# EAGLE board icyradio-exp-mmw-int (EAGLE 9.6.2), part 1 of 2
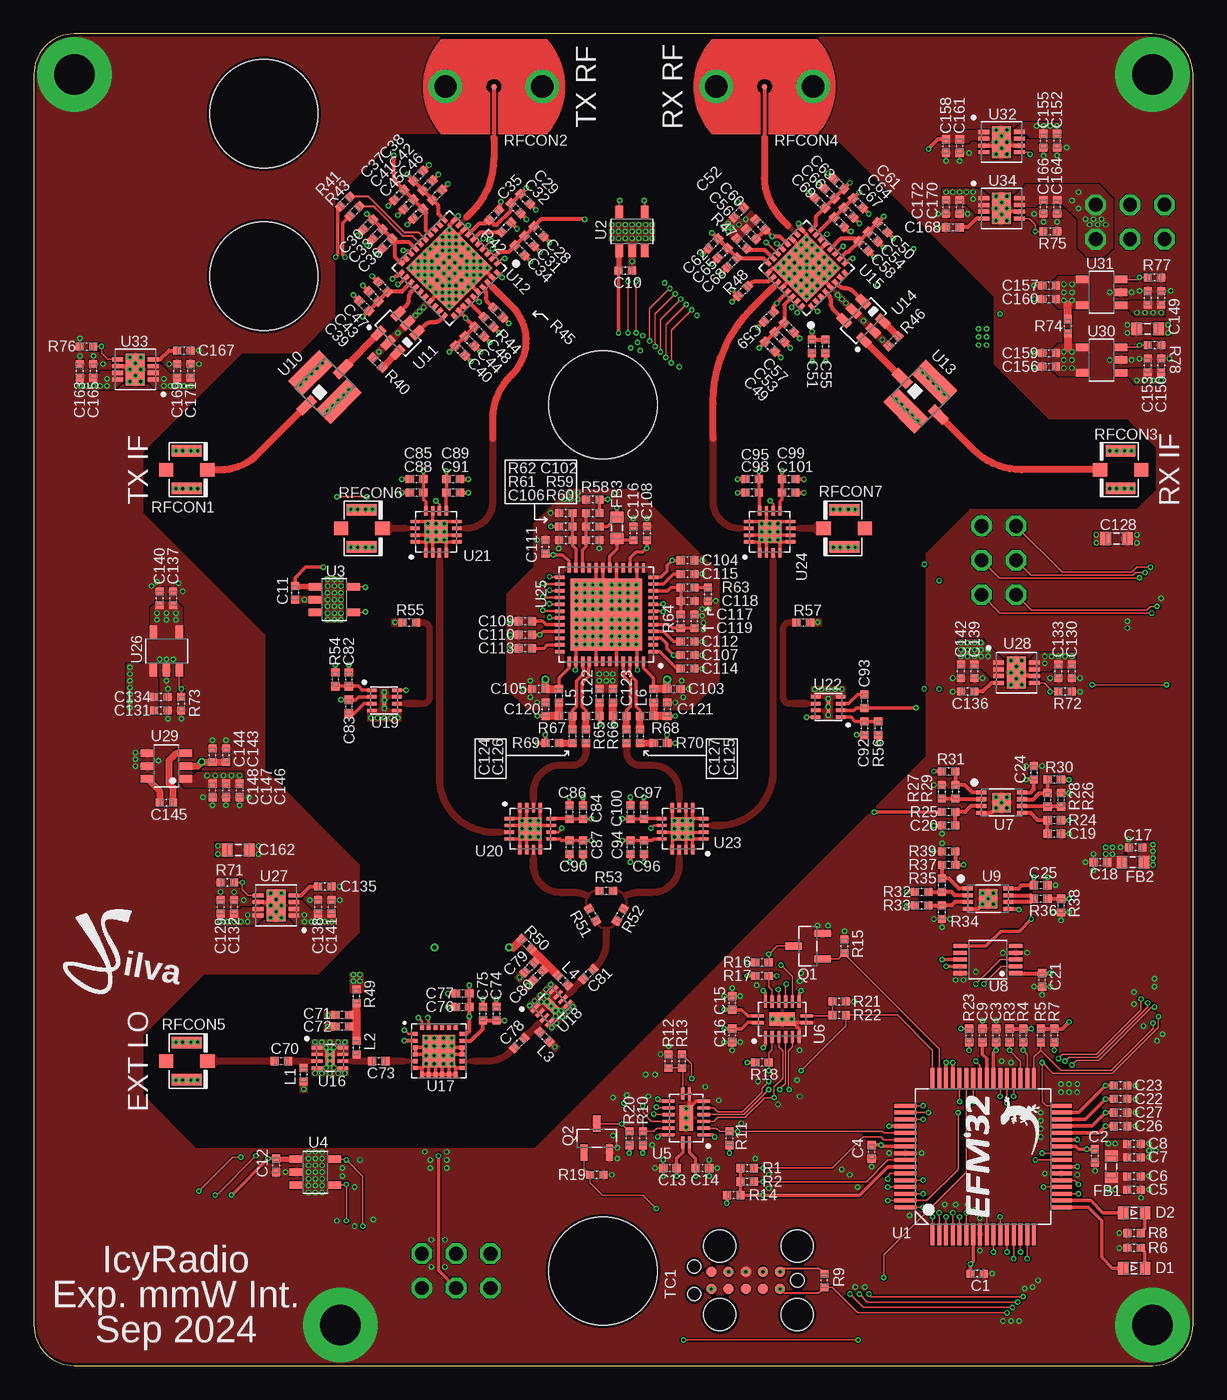
[diagram p11: board, top side]
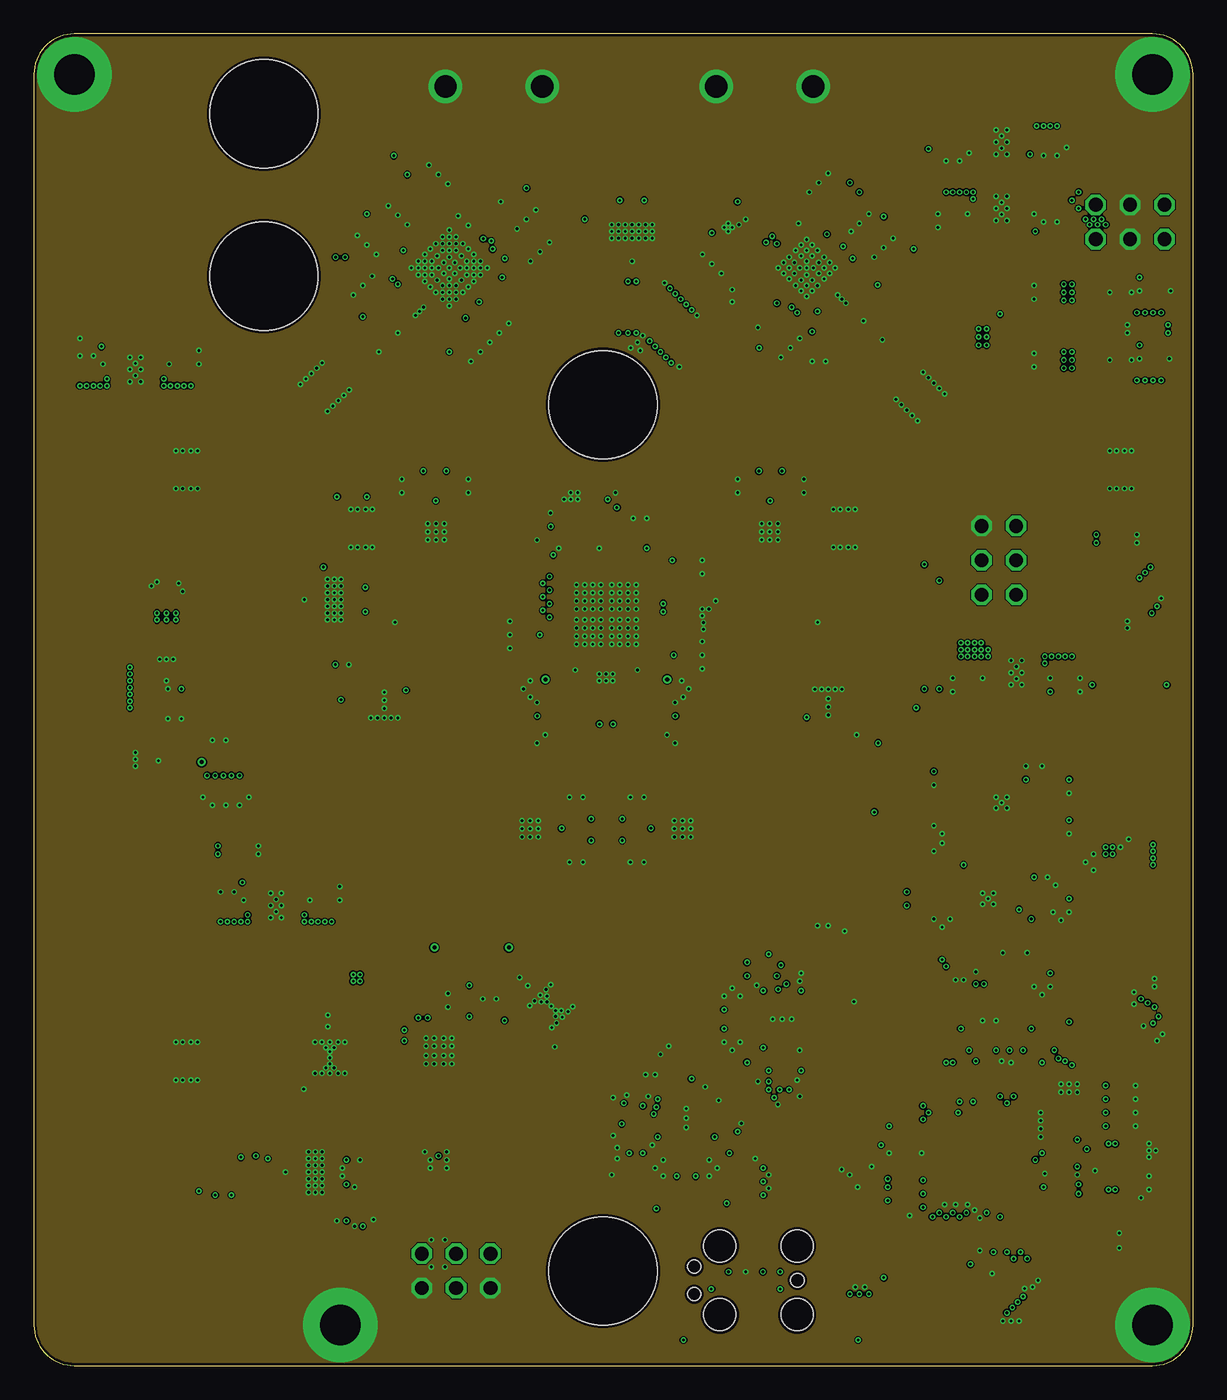
[diagram p12: board, inner layer Route2]
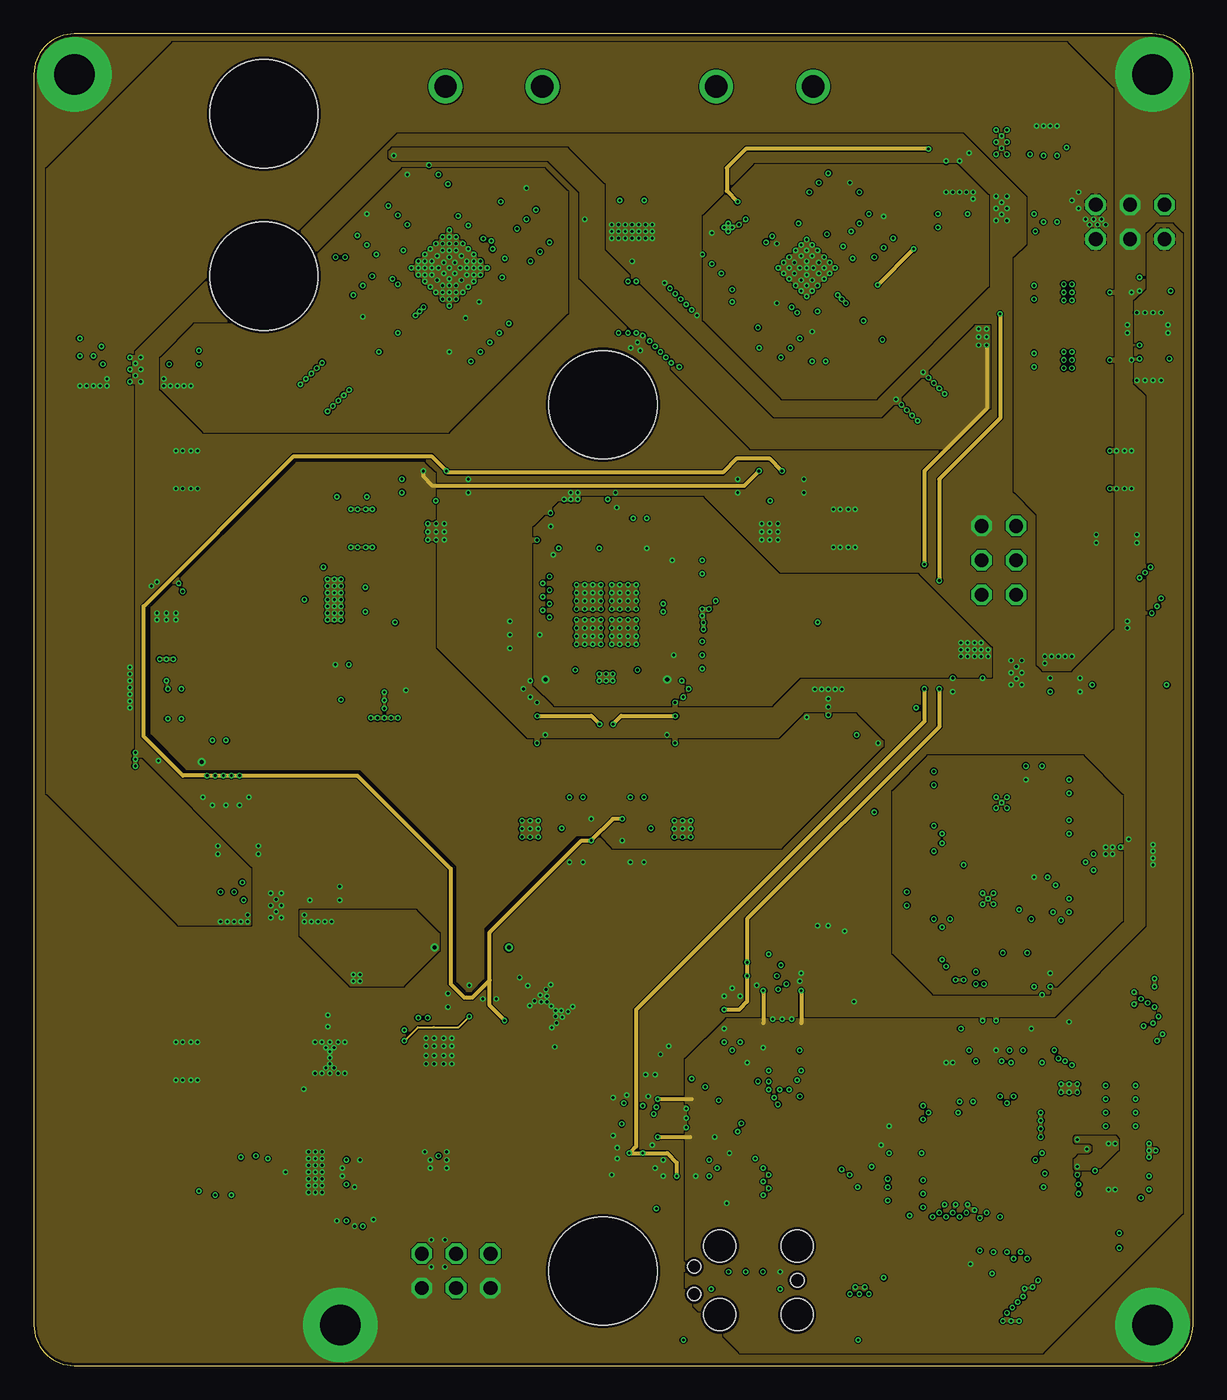
[diagram p13: board, inner layer Route15]
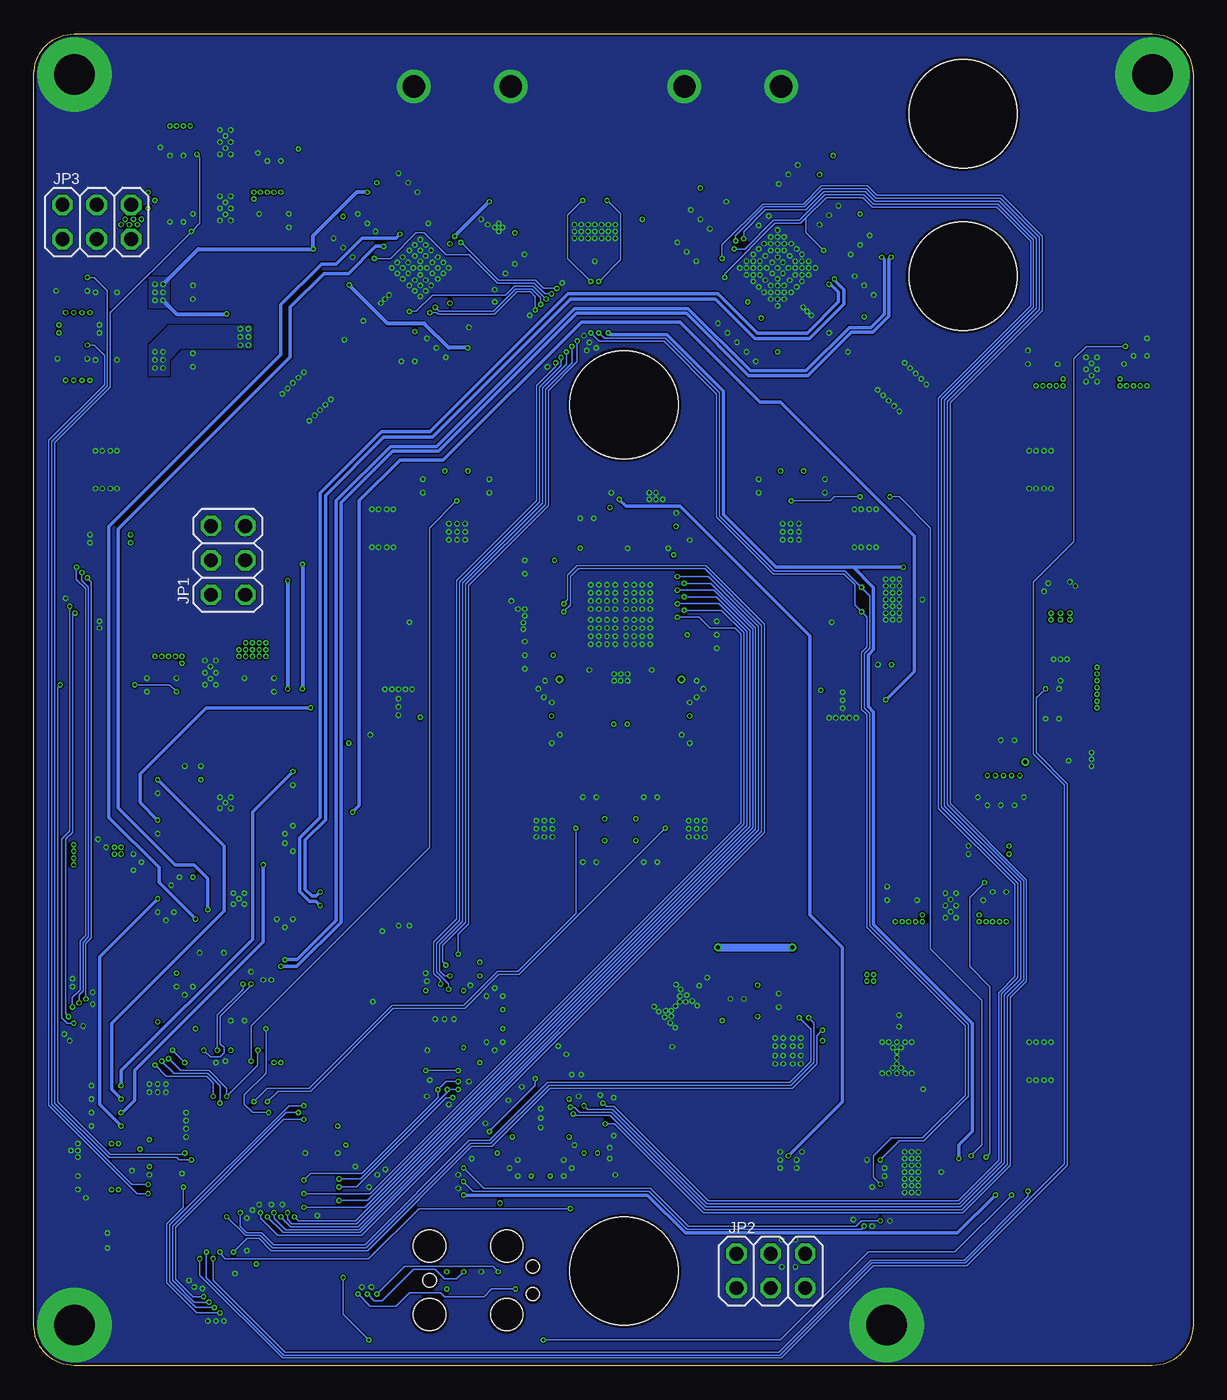
[diagram p14: board, bottom side, seen from below]

Size 85.65 x 98.4 mm. Coordinates in mm from the lower left corner, seen from the top.
Outline: 0,95.4 0,3 arc90 3,0 82.65,0 arc90 85.65,3 85.65,95.4 arc90 82.65,98.4 3,98.4 arc90 0,95.4
Copper layers (1+2*15+16): Top 0.035mm / dielectric 0.2mm / Route2 0.0175mm / dielectric 0.665mm / Route15 0.0175mm / dielectric 0.2mm / Bottom 0.035mm
Design rules "jlcpcb_4layer": minimum track width 3.5mil, minimum drill 0.2mm, track to track 3.5mil, track to pad 3.5mil, pad to pad 3.5mil, via to via 5mil, smd to smd 0mil, copper to edge 0.2mm, drill to drill 5mil, minimum pad ring 0.15mm, minimum via ring 0.1mm, stop-mask expansion 0.04mm, vias tented up to drill 10mm, thermal gap 3.5mil
Net classes: 1 Microstrip Diff Z50: width 0.254 mm, clearance 0.15 mm
Holes 8 mm at 42.05,71 17,80.5 17,92.5 42.05,7
bKeepout: area 0,4 to 8.2,12; area 0,16.5 to 8.2,24.5; area 0,29 to 8.2,37; area 0,41.5 to 8.2,49.5; area 0,54 to 8.2,62; area 0,66.5 to 8.2,74.5
tRestrict: area 65.4,34.6 to 65.8,35.4; area 65.4,33.6 to 65.8,34.4; area 66.7,35.3 to 67.5,35.7; area 66.7,33.3 to 67.5,33.7; area 67.4,36.6 to 67.8,37.4; area 67.4,37.6 to 67.8,38.4; area 74.2,34.1 to 74.6,34.9; area 74.2,35.1 to 74.6,35.9; area 75.5,33.8 to 76.3,34.2; area 67.4,39.5 to 67.8,40.3; area 67.4,40.5 to 67.8,41.3; area 66.7,42.2 to 67.5,42.6; 8 more areas

## Footprints (pad centres in the part's own frame; a part is rotated, then mirrored left to right if it is on the bottom)
CAP0402 = smd 0.6 x 0.6: 1 -0.5,0; 2 0.5,0
CAP0603 = smd 0.8 x 0.95: 1 -0.8,0; 2 0.8,0
0603 = smd 0.8 x 0.95: A 0.8,0; C -0.8,0
IND0603 = smd 0.8 x 0.95: 1 -0.8,0; 2 0.8,0
2X03 = drill 1.016 octagon: 1 -2.54,-1.27; 2 -2.54,1.27; 3 0,-1.27; 4 0,1.27; 5 2.54,-1.27; 6 2.54,1.27
IND0402 = smd 0.6 x 0.6: 1 -0.5,0; 2 0.5,0
SOT23 = smd 1.219 x 0.533: 1 -1.067,0.94; 2 -1.067,-0.94; 3 1.067,0
RES0402 = smd 0.6 x 0.6: 1 -0.5,0; 2 0.5,0
U.FL = smd 2.2 x 0.85: P$1 0,1.375; P$2 0,-1.375 | smd 1.05 x 1: P$3 1.525,0; P$4 -1.525,0
HK-R-SR2-SA = drill 1.65: GND@1 -3.58,0; GND@2 3.58,0 | smd 0.41 x 0.41: SIG 0,0
TC2050-IDC = smd 0.787 x 0.787: 1 -2.54,-0.635; 2 -1.27,-0.635; 3 0,-0.635; 4 1.27,-0.635; 5 2.54,-0.635; 6 2.54,0.635; 7 1.27,0.635; 8 0,0.635; 9 -1.27,0.635; 10 -2.54,0.635 | hole 0.991: -3.81,0; 3.81,1.016; 3.81,-1.016 | hole 2.375: -3.81,2.54; -3.81,-2.54; 1.905,2.54; 1.905,-2.54
QFP64 = smd 1.6 x 0.3: 1 -5.75,3.75; 2 -5.75,3.25; 3 -5.75,2.75; 4 -5.75,2.25; 5 -5.75,1.75; 6 -5.75,1.25; 7 -5.75,0.75; 8 -5.75,0.25; 9 -5.75,-0.25; 10 -5.75,-0.75; 11 -5.75,-1.25; 12 -5.75,-1.75; 13 -5.75,-2.25; 14 -5.75,-2.75; 15 -5.75,-3.25; 16 -5.75,-3.75; 33 5.75,-3.75; 34 5.75,-3.25; 35 5.75,-2.75; 36 5.75,-2.25; 37 5.75,-1.75; 38 5.75,-1.25; 39 5.75,-0.75; 40 5.75,-0.25; 41 5.75,0.25; 42 5.75,0.75; 43 5.75,1.25; 44 5.75,1.75; 45 5.75,2.25; 46 5.75,2.75; 47 5.75,3.25; 48 5.75,3.75 | smd 0.3 x 1.6: 17 -3.75,-5.75; 18 -3.25,-5.75; 19 -2.75,-5.75; 20 -2.25,-5.75; 21 -1.75,-5.75; 22 -1.25,-5.75; 23 -0.75,-5.75; 24 -0.25,-5.75; 25 0.25,-5.75; 26 0.75,-5.75; 27 1.25,-5.75; 28 1.75,-5.75; 29 2.25,-5.75; 30 2.75,-5.75; 31 3.25,-5.75; 32 3.75,-5.75; 49 3.75,5.75; 50 3.25,5.75; 51 2.75,5.75; 52 2.25,5.75; 53 1.75,5.75; 54 1.25,5.75; 55 0.75,5.75; 56 0.25,5.75; 57 -0.25,5.75; 58 -0.75,5.75; 59 -1.25,5.75; 60 -1.75,5.75; 61 -2.25,5.75; 62 -2.75,5.75; 63 -3.25,5.75; 64 -3.75,5.75
SOT23-5 = smd 1 x 0.55: 1 -1.4,0.95; 2 -1.4,0; 3 -1.4,-0.95; 4 1.4,-0.95; 5 1.4,0.95
DQFN16 = smd 0.24 x 0.9: 1 -0.25,1.8; 8 -0.25,-1.8; 9 0.25,-1.8; 16 0.25,1.8 | smd 0.9 x 0.24: 2 -1.3,1.25; 3 -1.3,0.75; 4 -1.3,0.25; 5 -1.3,-0.25; 6 -1.3,-0.75; 7 -1.3,-1.25; 10 1.3,-1.25; 11 1.3,-0.75; 12 1.3,-0.25; 13 1.3,0.25; 14 1.3,0.75; 15 1.3,1.25 | smd 1 x 1.9: 17 0,0
TDFN8 = smd 0.75 x 0.3: 1 -1.5,0.75; 2 -1.5,0.25; 3 -1.5,-0.25; 4 -1.5,-0.75; 5 1.5,-0.75; 6 1.5,-0.25; 7 1.5,0.25; 8 1.5,0.75 | smd 1.36 x 1.46: 9 0,0
MSOP10 = smd 0.3 x 1: 1 -1,-2.05; 2 -0.5,-2.05; 3 0,-2.05; 4 0.5,-2.05; 5 1,-2.05; 6 1,2.05; 7 0.5,2.05; 8 0,2.05; 9 -0.5,2.05; 10 -1,2.05
JV1210C = smd 1.5 x 0.7: 1 -1.9,0; 3 1.9,0 | smd 3.25 x 1.5: 2 0,-1.475; 4 0,1.475
FV1206-1 = smd 0.61 x 1.07: 1 -0.99,-1.025; 2 0,-1.025; 3 0.99,-1.025; 4 0.99,1.025; 5 0,1.025; 6 -0.99,1.025
LGA40 = smd 0.4 x 0.32: 1 -2.725,2.25; 2 -2.725,1.75; 3 -2.725,1.25; 4 -2.725,0.75; 5 -2.725,0.25; 6 -2.725,-0.25; 7 -2.725,-0.75; 8 -2.725,-1.25; 9 -2.725,-1.75; 10 -2.725,-2.25; 21 2.725,-2.25; 22 2.725,-1.75; 23 2.725,-1.25; 24 2.725,-0.75; 25 2.725,-0.25; 26 2.725,0.25; 27 2.725,0.75; 28 2.725,1.25; 29 2.725,1.75; 30 2.725,2.25 | smd 0.32 x 0.4: 11 -2.25,-2.725; 12 -1.75,-2.725; 13 -1.25,-2.725; 14 -0.75,-2.725; 15 -0.25,-2.725; 16 0.25,-2.725; 17 0.75,-2.725; 18 1.25,-2.725; 19 1.75,-2.725; 20 2.25,-2.725; 31 2.25,2.725; 32 1.75,2.725; 33 1.25,2.725; 34 0.75,2.725; 35 0.25,2.725; 36 -0.25,2.725; 37 -0.75,2.725; 38 -1.25,2.725; 39 -1.75,2.725; 40 -2.25,2.725 | smd 4.5 x 4.5: 41 0,0
LGA32 = smd 0.4 x 0.32: 1 -2.225,1.75; 2 -2.225,1.25; 3 -2.225,0.75; 4 -2.225,0.25; 5 -2.225,-0.25; 6 -2.225,-0.75; 7 -2.225,-1.25; 8 -2.225,-1.75; 17 2.225,-1.75; 18 2.225,-1.25; 19 2.225,-0.75; 20 2.225,-0.25; 21 2.225,0.25; 22 2.225,0.75; 23 2.225,1.25; 24 2.225,1.75 | smd 0.32 x 0.4: 9 -1.75,-2.225; 10 -1.25,-2.225; 11 -0.75,-2.225; 12 -0.25,-2.225; 13 0.25,-2.225; 14 0.75,-2.225; 15 1.25,-2.225; 16 1.75,-2.225; 25 1.75,2.225; 26 1.25,2.225; 27 0.75,2.225; 28 0.25,2.225; 29 -0.25,2.225; 30 -0.75,2.225; 31 -1.25,2.225; 32 -1.75,2.225 | smd 3.6 x 3.6: 33 0,0
MC1631-1 = smd 0.25 x 0.8: 1 -0.75,-0.95; 2 -0.25,-0.95; 3 0.25,-0.95; 4 0.75,-0.95; 5 0.75,0.95; 6 0.25,0.95; 7 -0.25,0.95; 8 -0.75,0.95 | smd 1.25 x 0.65: 9 0,0
LGA24 = smd 0.35 x 0.3: 1 -1.725,1.25; 2 -1.725,0.75; 3 -1.725,0.25; 4 -1.725,-0.25; 5 -1.725,-0.75; 6 -1.725,-1.25; 13 1.725,-1.25; 14 1.725,-0.75; 15 1.725,-0.25; 16 1.725,0.25; 17 1.725,0.75; 18 1.725,1.25 | smd 0.3 x 0.35: 7 -1.25,-1.725; 8 -0.75,-1.725; 9 -0.25,-1.725; 10 0.25,-1.725; 11 0.75,-1.725; 12 1.25,-1.725; 19 1.25,1.725; 20 0.75,1.725; 21 0.25,1.725; 22 -0.25,1.725; 23 -0.75,1.725; 24 -1.25,1.725 | smd 2.4 x 2.4: 25 0,0
DFN8_2X2 = smd 0.7 x 0.25: 1 -0.925,0.75; 2 -0.925,0.25; 3 -0.925,-0.25; 4 -0.925,-0.75; 5 0.925,-0.75; 6 0.925,-0.25; 7 0.925,0.25; 8 0.925,0.75 | smd 0.25 x 1.6: 9 0,0
LFCSP16 = smd 0.7 x 0.25: 1 -1.55,0.75; 2 -1.55,0.25; 3 -1.55,-0.25; 4 -1.55,-0.75; 9 1.55,-0.75; 10 1.55,-0.25; 11 1.55,0.25; 12 1.55,0.75 | smd 0.25 x 0.7: 5 -0.75,-1.55; 6 -0.25,-1.55; 7 0.25,-1.55; 8 0.75,-1.55; 13 0.75,1.55; 14 0.25,1.55; 15 -0.25,1.55; 16 -0.75,1.55 | smd 1.7 x 1.7: 17 0,0
VFQFPN48 = smd 0.7 x 0.25: 1 -3.45,2.75; 2 -3.45,2.25; 3 -3.45,1.75; 4 -3.45,1.25; 5 -3.45,0.75; 6 -3.45,0.25; 7 -3.45,-0.25; 8 -3.45,-0.75; 9 -3.45,-1.25; 10 -3.45,-1.75; 11 -3.45,-2.25; 12 -3.45,-2.75; 25 3.45,-2.75; 26 3.45,-2.25; 27 3.45,-1.75; 28 3.45,-1.25; 29 3.45,-0.75; 30 3.45,-0.25; 31 3.45,0.25; 32 3.45,0.75; 33 3.45,1.25; 34 3.45,1.75; 35 3.45,2.25; 36 3.45,2.75 | smd 0.25 x 0.7: 13 -2.75,-3.45; 14 -2.25,-3.45; 15 -1.75,-3.45; 16 -1.25,-3.45; 17 -0.75,-3.45; 18 -0.25,-3.45; 19 0.25,-3.45; 20 0.75,-3.45; 21 1.25,-3.45; 22 1.75,-3.45; 23 2.25,-3.45; 24 2.75,-3.45; 37 2.75,3.45; 38 2.25,3.45; 39 1.75,3.45; 40 1.25,3.45; 41 0.75,3.45; 42 0.25,3.45; 43 -0.25,3.45; 44 -0.75,3.45; 45 -1.25,3.45; 46 -1.75,3.45; 47 -2.25,3.45; 48 -2.75,3.45 | smd 5.3 x 5.3: 49 0,0
LFCSP8_3X3 = smd 0.8 x 0.3: 1 -1.315,0.75; 2 -1.315,0.25; 3 -1.315,-0.25; 4 -1.315,-0.75; 5 1.315,-0.75; 6 1.315,-0.25; 7 1.315,0.25; 8 1.315,0.75 | smd 1.4 x 2.36: 9 0,0
SOT23-6 = smd 1 x 0.55: 1 -1.4,0.95; 2 -1.4,0; 3 -1.4,-0.95; 4 1.4,-0.95; 5 1.4,0; 6 1.4,0.95

## Placement (x,y rotation side)
C1  100nF  [CAP0402]  69.7,6.8 0 top
C2  100nF  [CAP0402]  78.4,15.5 270 top
C3  100nF  [CAP0402]  71.1,24.4 90 top
C4  100nF  [CAP0402]  61.9,15.8 270 top
C5  100nF  [CAP0402]  81.3,13 0 top
C6  1uF  [CAP0402]  81.3,14 0 top
C7  10uF  [CAP0402]  81.3,15.4 0 top
C8  100nF  [CAP0402]  81.3,16.4 0 top
C9  1uF  [CAP0402]  70.1,24.4 90 top
C10  100nF  [CAP0402]  43.7,80.9 0 top
C11  100nF  [CAP0402]  19.3,57.1 270 top
C12  100nF  [CAP0402]  17.9,14.8 270 top
C13  100nF  [CAP0402]  47,14.6 180 top
C14  100nF  [CAP0402]  49.4,14.6 0 top
C15  100nF  [CAP0402]  51.6,26.8 90 top
C16  100nF  [CAP0402]  51.6,24.4 270 top
C17  1uF  [CAP0402]  81.4,38.3 180 top
C18  10uF  [CAP0402]  78.8,37.2 180 top
C19  1nF  [CAP0402]  75.4,39.3 0 top
C20  1nF  [CAP0402]  67.6,39.9 180 top
C21  100nF  [CAP0402]  74.5,28.5 270 top
C22  100nF  [CAP0402]  80.3,19.7 0 top
C23  100nF  [CAP0402]  80.3,20.7 0 top
C24  100nF  [CAP0402]  73.9,43.8 90 top
C25  100nF  [CAP0402]  74.4,35.5 0 top
C26  330pF  [CAP0402]  80.3,17.7 0 top
C27  330pF  [CAP0402]  80.3,18.7 0 top
C28  10uF  [CAP0402]  37.3,83.8 315 top
C29  10uF  [CAP0402]  36.3,86.2 315 top
C30  10uF  [CAP0402]  24.7,84.3 225 top
C31  10nF  [CAP0402]  36.6,83.1 315 top
C32  10nF  [CAP0402]  35.6,85.5 315 top
C33  10nF  [CAP0402]  25.4,83.6 225 top
C34  100pF  [CAP0402]  35.9,82.4 315 top
C35  100pF  [CAP0402]  34,85 45 top
C36  100pF  [CAP0402]  26.1,82.9 225 top
C37  10uF  [CAP0402]  27,86.5 225 top
C38  10uF  [CAP0402]  28.4,87.9 45 top
C39  10uF  [CAP0402]  24.4,78.3 135 top
C40  10uF  [CAP0402]  31.5,75 315 top
C41  10nF  [CAP0402]  27.7,85.8 225 top
C42  10nF  [CAP0402]  29.1,87.2 45 top
C43  10nF  [CAP0402]  25.1,79 135 top
C44  10nF  [CAP0402]  32.2,75.7 315 top
C45  100pF  [CAP0402]  28.4,85.1 225 top
C46  100pF  [CAP0402]  29.8,86.5 45 top
C47  100pF  [CAP0402]  25.8,79.7 135 top
C48  100pF  [CAP0402]  32.9,76.4 315 top
C49  10uF  [CAP0402]  54.4,75.3 315 top
C50  10uF  [CAP0402]  62.7,84.1 315 top
C51  10uF  [CAP0402]  57.5,75.3 270 top
C52  10uF  [CAP0402]  52.1,85.2 225 top
C53  10nF  [CAP0402]  55.1,76 315 top
C54  10nF  [CAP0402]  62,83.4 315 top
C55  10nF  [CAP0402]  58.5,75.3 270 top
C56  10nF  [CAP0402]  53,83.6 135 top
C57  100pF  [CAP0402]  55.8,76.7 315 top
C58  100pF  [CAP0402]  61.3,82.7 315 top
C59  100pF  [CAP0402]  54.3,77.5 225 top
C60  100pF  [CAP0402]  53.7,84.3 135 top
C61  10uF  [CAP0402]  60.9,85.9 315 top
C62  10uF  [CAP0402]  50.2,82.9 225 top
C63  10uF  [CAP0402]  59.5,87.3 135 top
C64  10nF  [CAP0402]  60.2,85.2 315 top
C65  10nF  [CAP0402]  50.9,82.2 225 top
C66  10nF  [CAP0402]  58.8,86.6 135 top
C67  100pF  [CAP0402]  59.5,84.5 315 top
C68  100pF  [CAP0402]  51.6,81.5 225 top
C69  100pF  [CAP0402]  58.1,85.9 135 top
C70  2.2pF  [CAP0402]  18.28,22.5 0 top
C71  10uF  [CAP0402]  22.78,25.91 180 top
C72  2.2pF  [CAP0402]  22.78,25.06 180 top
C73  2.2pF  [CAP0402]  25.49,22.5 0 top
C74  100nF  [CAP0402]  34.18,26 90 top
C75  100pF  [CAP0402]  33.18,26 90 top
C76  100pF  [CAP0402]  31.68,26.5 180 top
C77  100nF  [CAP0402]  31.68,27.5 180 top
C78  2.2pF  [CAP0402]  35.87,23.84 45 top
C79  10uF  [CAP0402]  36.64,29.43 225 top
C80  2.2pF  [CAP0402]  37.24,28.83 225 top
C81  2.2pF  [CAP0402]  40.96,28.93 45 top
C82  100nF  [CAP0402]  23.28,50.7 90 top
C83  10nF  [CAP0402]  23.28,48.7 270 top
C84  100nF  [CAP0402]  40.58,40.9 90 top
C85  100nF  [CAP0402]  28.28,65.5 180 top
C86  100pF  [CAP0402]  39.58,40.9 90 top
C87  100nF  [CAP0402]  40.58,38.3 270 top
C88  100pF  [CAP0402]  28.28,64.5 180 top
C89  100nF  [CAP0402]  30.98,65.5 0 top
C90  100pF  [CAP0402]  39.58,38.3 270 top
C91  100pF  [CAP0402]  30.98,64.5 0 top
C92  100nF  [CAP0402]  61.38,47.1 270 top
C93  10nF  [CAP0402]  61.38,49.1 90 top
C94  100nF  [CAP0402]  44.08,38.3 270 top
C95  100nF  [CAP0402]  53.08,65.5 180 top
C96  100pF  [CAP0402]  45.08,38.3 270 top
C97  100nF  [CAP0402]  45.08,40.9 90 top
C98  100pF  [CAP0402]  53.08,64.5 180 top
C99  100nF  [CAP0402]  55.78,65.5 0 top
C100  100pF  [CAP0402]  44.08,40.9 90 top
C101  100pF  [CAP0402]  55.78,64.5 0 top
C102  100nF  [CAP0402]  41.3,63 180 top
C103  100nF  [CAP0402]  47.3,50 0 top
C104  100nF  [CAP0402]  48.3,59.5 0 top
C105  100nF  [CAP0402]  37.3,50 180 top
C106  100nF  [CAP0402]  39.3,61 180 top
C107  100nF  [CAP0402]  48.3,52.5 0 top
C108  100nF  [CAP0402]  45.3,61.5 90 top
C109  22uF  [CAP0402]  36.3,55 180 top
C110  100nF  [CAP0402]  36.3,54 180 top
C111  100nF  [CAP0402]  37.8,60.5 90 top
C112  22uF  [CAP0402]  48.3,53.5 0 top
C113  22uF  [CAP0402]  36.3,53 180 top
C114  22uF  [CAP0402]  48.3,51.5 0 top
C115  22uF  [CAP0402]  48.3,58.5 0 top
C116  1uF  [CAP0402]  44.3,61.5 90 top
C117  1uF  [CAP0402]  49.8,57 270 top
C118  10nF  [CAP0402]  48.3,56.5 0 top
C119  2.2nF  [CAP0402]  48.8,55 90 top
C120  10nF  [CAP0402]  37.8,48.5 90 top
C121  10nF  [CAP0402]  46.8,48.5 90 top
C122  10pF  [CAP0402]  41.8,49.5 90 top
C123  10pF  [CAP0402]  42.8,49.5 90 top
C124  10nF  [CAP0402]  39.8,46.5 270 top
C125  10nF  [CAP0402]  44.8,46.5 270 top
C126  10nF  [CAP0402]  40.8,46.5 270 top
C127  10nF  [CAP0402]  43.8,46.5 270 top
C128  10uF  [CAP0603]  80,61.1 0 top
C129  1uF  [CAP0402]  13.8,33.9 90 top
C130  1uF  [CAP0402]  76.7,51.3 270 top
C131  1uF  [CAP0402]  9.4,48.4 0 top
C132  100nF  [CAP0402]  14.8,33.9 90 top
C133  100nF  [CAP0402]  75.7,51.3 270 top
C134  100nF  [CAP0402]  9.4,49.4 0 top
C135  10nF  [CAP0402]  21.5,35.4 0 top
C136  10nF  [CAP0402]  69,49.8 180 top
C137  1uF  [CAP0402]  10.3,56.7 90 top
C138  1uF  [CAP0402]  21,33.9 90 top
C139  1uF  [CAP0402]  69.5,51.3 270 top
C140  10uF  [CAP0402]  9.3,56.7 90 top
C141  10uF  [CAP0402]  22,33.9 90 top
C142  10uF  [CAP0402]  68.5,51.3 270 top
C143  1uF  [CAP0402]  14.2,45.1 90 top
C144  100nF  [CAP0402]  13.2,45.1 90 top
C145  1uF  [CAP0402]  9.8,41.6 0 top
C146  10uF  [CAP0402]  15.2,42.5 270 top
C147  100nF  [CAP0402]  14.2,42.5 270 top
C148  10pF  [CAP0402]  13.2,42.5 270 top
C149  10uF  [CAP0603]  82.3,76.6 180 top
C150  1uF  [CAP0402]  83.3,73.9 90 top
C151  1uF  [CAP0402]  83.3,78.9 90 top
C152  1uF  [CAP0402]  75.6,90.5 270 top
C153  100nF  [CAP0402]  82.3,73.9 90 top
C154  100nF  [CAP0402]  82.3,78.9 90 top
C155  100nF  [CAP0402]  74.6,90.5 270 top
C156  1uF  [CAP0402]  75,73.8 180 top
C157  1uF  [CAP0402]  75,79.8 180 top
C158  1uF  [CAP0402]  67.4,90.1 270 top
C159  10uF  [CAP0402]  75,74.8 180 top
C160  10uF  [CAP0402]  75,78.8 180 top
C161  10uF  [CAP0402]  68.4,90.1 270 top
C162  10uF  [CAP0603]  15.1,38.1 0 top
C163  1uF  [CAP0402]  3.4,73.5 90 top
C164  1uF  [CAP0402]  75.6,85.6 270 top
C165  100nF  [CAP0402]  4.4,73.5 90 top
C166  100nF  [CAP0402]  74.6,85.6 270 top
C167  10nF  [CAP0402]  11.1,75 0 top
C168  10nF  [CAP0402]  67.9,84.1 180 top
C169  1uF  [CAP0402]  10.6,73.5 90 top
C170  1uF  [CAP0402]  68.4,85.6 270 top
C171  10uF  [CAP0402]  11.6,73.5 90 top
C172  10uF  [CAP0402]  67.4,85.6 270 top
D1  LED0603  [0603]  81.3,7.2 180 top
D2  LED0603  [0603]  81.3,11.3 180 top
FB1  1uH  [IND0603]  79.6,14.7 90 top
FB2  1uH  [IND0603]  81.2,37.2 180 top
FB3  1uH  [IND0603]  43.1,61.9 270 top
JP1  PINHD-2X3  [2X03]  71.3,59.5 90 bottom
JP2  PINHD-2X3  [2X03]  31.2,7 0 bottom
JP3  PINHD-2X3  [2X03]  81,84.5 0 bottom
L1  8.8nH  [IND0402]  19.94,21.5 270 top
L2  8.8nH  [IND0402]  23.84,23.5 270 top
L3  8.8nH  [IND0402]  37.75,24.3 315 top
L4  8.8nH  [IND0402]  39.08,28.47 315 top
L5  18nH  [IND0402]  38.8,49.5 270 top
L6  18nH  [IND0402]  45.8,49.5 270 top
LOGO1  JSILVA-5MM  [JSILVA_5MM]  7.4,33.9 0 top
Q1  AO3400  [SOT23]  57.2,31 180 top
Q2  AO3400  [SOT23]  41.6,16.8 90 top
R1  4.7K Ohms  [RES0402]  52.7,14.6 180 top
R2  4.7K Ohms  [RES0402]  52.7,13.6 180 top
R3  4.7K Ohms  [RES0402]  72.1,24.4 90 top
R4  4.7K Ohms  [RES0402]  73.1,24.4 90 top
R5  4.7K Ohms  [RES0402]  74.4,24.4 90 top
R6  1K Ohms  [RES0402]  81.3,8.7 0 top
R7  4.7K Ohms  [RES0402]  75.4,24.4 90 top
R8  1K Ohms  [RES0402]  81.3,9.8 0 top
R9  10K Ohms  [RES0402]  58.4,6.3 90 top
R10  10K Ohms  [RES0402]  45,16.8 270 top
R11  10K Ohms  [RES0402]  51.4,16.8 270 top
R12  DNP  [RES0402]  46.9,22.5 90 top
R13  0 Ohms  [RES0402]  47.9,22.5 270 top
R14  DNP  [RES0402]  51.7,12.6 180 top
R15  10K Ohms  [RES0402]  59.9,31 270 top
R16  10K Ohms  [RES0402]  53.8,29.8 180 top
R17  10K Ohms  [RES0402]  53.8,28.8 180 top
R18  10K Ohms  [RES0402]  53.8,22.4 180 top
R19  10K Ohms  [RES0402]  41.6,14.1 180 top
R20  10K Ohms  [RES0402]  44,16.8 270 top
R21  DNP  [RES0402]  59.5,26.9 0 top
R22  0 Ohms  [RES0402]  59.5,25.9 180 top
R23  DNP  [RES0402]  69.1,24.4 90 top
R24  0 Ohms  [RES0402]  75.4,40.3 0 top
R25  0 Ohms  [RES0402]  67.6,40.9 180 top
R26  1K Ohms  [RES0402]  75.9,41.8 270 top
R27  1K Ohms  [RES0402]  67.1,42.4 270 top
R28  2K Ohms  [RES0402]  74.9,41.8 270 top
R29  2K Ohms  [RES0402]  68.1,42.4 270 top
R30  100 Ohms  [RES0402]  75.4,43.3 180 top
R31  100 Ohms  [RES0402]  67.6,43.9 0 top
R32  1K Ohms  [RES0402]  65.6,35 180 top
R33  1K Ohms  [RES0402]  65.6,34 180 top
R34  10K Ohms  [RES0402]  67.1,33.5 90 top
R35  10K Ohms  [RES0402]  67.1,35.5 270 top
R36  2K Ohms  [RES0402]  74.4,34.5 180 top
R37  2K Ohms  [RES0402]  67.6,37 180 top
R38  DNP  [RES0402]  75.9,34 90 top
R39  DNP  [RES0402]  67.6,38 0 top
R40  50 Ohms  [RES0402]  25.4,74.1 315 top
R41  1K Ohms  [RES0402]  23,86 45 top
R42  1.1K Ohms  [RES0402]  34.9,84.1 225 top
R43  1K Ohms  [RES0402]  23.7,85.3 45 top
R44  1.1K Ohms  [RES0402]  33.6,77.1 135 top
R45  50 Ohms  [RES0402]  34.3,77.8 135 top
R46  50 Ohms  [RES0402]  63.5,75.7 45 top
R47  1.1K Ohms  [RES0402]  52.3,82.9 315 top
R48  50 Ohms  [RES0402]  52.4,79.4 45 top
R49  0 Ohms  [RES0402]  23.84,27.3 90 top
R50  0 Ohms  [RES0402]  36.4,31.16 135 top
R51  50 Ohms  [RES0402]  41.28,33.31 300 top
R52  50 Ohms  [RES0402]  43.32,33.31 240 top
R53  50 Ohms  [RES0402]  42.3,35.08 0 top
R54  1 Ohms  [RES0402]  22.28,50.7 90 top
R55  50 Ohms  [RES0402]  27.74,54.91 0 top
R56  1 Ohms  [RES0402]  62.38,47.1 270 top
R57  50 Ohms  [RES0402]  56.86,54.91 180 top
R58  49.9 Ohms  [RES0402]  41.3,64 0 top
R59  1K Ohms  [RES0402]  41.3,62 0 top
R60  1K Ohms  [RES0402]  41.3,61 180 top
R61  1K Ohms  [RES0402]  39.3,62 180 top
R62  1K Ohms  [RES0402]  39.3,63 0 top
R63  20 Ohms  [RES0402]  48.3,57.5 180 top
R64  62 Ohms  [RES0402]  47.8,55 90 top
R65  50 Ohms  [RES0402]  41.3,48 0 top
R66  50 Ohms  [RES0402]  43.3,48 180 top
R67  50 Ohms  [RES0402]  39.3,48 180 top
R68  50 Ohms  [RES0402]  45.3,48 0 top
R69  50 Ohms  [RES0402]  38.3,46 0 top
R70  50 Ohms  [RES0402]  46.3,46 180 top
R71  10K Ohms  [RES0402]  14.3,35.7 0 top
R72  10K Ohms  [RES0402]  76.2,49.8 180 top
R73  10K Ohms  [RES0402]  10.9,48.9 90 top
R74  0 Ohms  [RES0402]  76.4,76.8 90 top
R75  10K Ohms  [RES0402]  75.1,83.8 180 top
R76  10K Ohms  [RES0402]  3.9,75.3 0 top
R77  10K Ohms  [RES0402]  82.8,80.4 180 top
R78  10K Ohms  [RES0402]  82.8,75.4 180 top
RFCON1  RFCON-U.FL  [U.FL]  11.3,66.2 0 top
RFCON2  RFCON-HK-R-SR2-SA  [HK-R-SR2-SA]  34,94.5 0 top
RFCON3  RFCON-U.FL  [U.FL]  80.3,66.2 180 top
RFCON4  RFCON-HK-R-SR2-SA  [HK-R-SR2-SA]  54,94.5 0 top
RFCON5  RFCON-U.FL  [U.FL]  11.3,22.5 0 top
RFCON6  RFCON-U.FL  [U.FL]  24.22,61.86 0 top
RFCON7  RFCON-U.FL  [U.FL]  59.88,61.86 180 top
TC1  TC2050-IDC  [TC2050-IDC]  52.6,6.3 180 top
U1  EFM32GG11B420F2048GQ64  [QFP64]  70.15,15.45 90 top
U2  MCP9802-A0  [SOT23-5]  44.2,83.8 90 top
U3  MCP9802-A1  [SOT23-5]  22.2,56.6 0 top
U4  MCP9802-A3  [SOT23-5]  20.8,14.3 0 top
U5  FXL4TD245BQX  [DQFN16]  48.2,18.3 180 top
U6  FXL4TD245BQX  [DQFN16]  55.3,25.6 90 top
U7  MCP6V32-E/MNY  [TDFN8]  71.5,41.6 0 top
U8  MCP4728-A0  [MSOP10]  70.5,30 90 top
U9  MCP6V32-E/MNY  [TDFN8]  70.5,34.5 0 top
U10  BFCV-2895+  [JV1210C]  21.5,72.3 45 top
U11  QCN-34+  [FV1206-1]  26.9,76.3 315 top
U12  ADMV1013  [LGA40]  30.7,81.1 225 top
U13  BFCV-2895+  [JV1210C]  65.5,71.6 315 top
U14  QCN-34+  [FV1206-1]  61.3,77.2 45 top
U15  ADMV1014  [LGA32]  57.1,81.1 135 top
U16  PMA2-123LN+  [MC1631-1]  21.89,22.75 270 top
U17  ADRF5720  [LGA24]  29.92,23.25 0 top
U18  PMA2-123LN+  [MC1631-1]  38.24,26.56 315 top
U19  LTC5597  [DFN8_2X2]  25.89,49.16 0 top
U20  ADRF5019  [LFCSP16]  36.67,39.66 0 top
U21  ADRF5019  [LFCSP16]  29.72,61.61 90 top
U22  LTC5597  [DFN8_2X2]  58.71,48.67 180 top
U23  ADRF5019  [LFCSP16]  47.93,39.66 180 top
U24  ADRF5019  [LFCSP16]  54.38,61.61 90 top
U25  8V97003  [VFQFPN48]  42.3,55.5 180 top
U26  ADP7142AUJZ-3.3  [SOT23-5]  9.8,52.8 90 top
U27  ADM7170ACPZ-5.0  [LFCSP8_3X3]  17.9,34 180 top
U28  ADM7172ACPZ-3.3  [LFCSP8_3X3]  72.6,51.2 0 top
U29  ADM8828  [SOT23-6]  9.8,44.3 180 top
U30  ADP7142AUJZ-1.8  [SOT23-5]  78.9,74.3 180 top
U31  ADP7142AUJZ-1.8  [SOT23-5]  78.9,79.3 180 top
U32  ADP7102ACPZ-1.5  [LFCSP8_3X3]  71.5,90.4 0 top
U33  ADM7171ACPZ-3.3  [LFCSP8_3X3]  7.5,73.6 180 top
U34  ADM7171ACPZ-3.3  [LFCSP8_3X3]  71.5,85.5 0 top

## Tracks (layer width: path | path; a pad name or v marks a point on that pad's centre or on a via)
1V5_RF_RX  (via drill 0.2)
  Top 0.305: v54.55,83.45 55.11,83.45 U15.20 | v54.55,83.45 | v54.55,83.45 C60.1 C56.1 | C52.1 v52.01,86 v52,86 | C158.1 66.8,90.6 v66.1,89.9
  Route15 0.305: v66.1,89.9 52.6,89.9 51.2,88.5 51.2,86.8 v52,86
  Bottom 0.305: v52,86 v54.55,83.45
  pour Top (no thermals): 70.48,90.6 70.48,91.2 67.2,91.2 67.2,90.4 69,90.4 69.2,90.6
1V8_RF_RX  (via drill 0.2)
  Top 0.254: U6.16 52.75,25.85 52.3,26.3 C15.1
  Top 0.305: U15.30 55.45,78.39 C57.1 C53.1 C49.1 v53.6,75.21 v53.6,75.2 | U15.15 59.09,84.85 C67.1 C64.1 C61.1 v60.99,86.7 v61,86.7 | C15.1 v51,26.3 | v52.7,29.8 R16.2 | R17.2 v52.7,28.8
  Top 0.6: R74.2 76.4,78.4
  Route15 0.305: v62.35,79.85 v65,82.5 | v71.4,77.7 71.4,70 66.9,65.5 v66.9,58 | v66.9,50 66.9,47.2 52.7,33 v52.7,29.8 v52.7,28.8 52.7,26.9 52.1,26.3 v51,26.3
  Bottom 0.305: v76.1,79.9 73.5,82.5 v65,82.5 65,83.5 61.8,86.7 v61,86.7 | v53.6,75.2 55,75.2 56.8,77 59.5,77 v62.35,79.85 | v76.1,78.7 75.1,77.7 v71.4,77.7 | v66.9,58 v66.9,50
  other vias: 76.7,79.9 76.7,79.3 76.1,79.3 76.7,78.7
  pour Top (no thermals): 77.9,80.42 77.9,78.17 75.72,78.17 75.3,78.6 75.3,80 75.72,80.42
  pour Bottom (no thermals): 75.7,80.4 77.1,80.4 77.1,78.2 75.7,78.2
1V8_RF_TX  (via drill 0.2)
  Top 0.254: U5.16 47.95,15.75 47.5,15.3 C13.1
  Top 0.305: U12.2 34.09,82.02 34.1,82.02 34.38,82.3 35.1,82.3 C34.1 C31.1 C28.1 37.49,84.7 v40.7,84.7 | U12.14 29,83.86 29,85.21 C45.1 C41.1 C37.1 26.6,87.61 v26.6,89.4 | C13.1 v47.5,14 | R10.2 v45,15.7 | R20.2 v44,15.7
  Top 0.6: R74.1 76.4,75.2
  Route15 0.305: v70.4,75.4 70.4,70.7 65.8,66.1 v65.8,59.2 | v65.8,50 65.8,47.6 44.5,26.3 44.5,16.2 v44,15.7 v45,15.7 46.8,15.7 47.5,15 v47.5,14
  Bottom 0.305: v65.8,59.2 v65.8,50
  other vias: 76.1,74.3 76.7,74.3 76.7,74.9 76.1,74.9 76.1,73.7 76.7,73.7 69.8,76.6 70.4,76.6 69.8,76 69.8,75.4 70.4,76
  pour Top (no thermals): 77.9,75.42 77.9,73.17 75.72,73.17 75.3,73.6 75.3,75 75.72,75.42
  pour Bottom (no thermals): 75.7,73.2 75.7,74.3 74.8,75.2 69.6,75.2 69.6,76.8 75.7,76.8 77.1,75.4 77.1,73.2
  pour Route15: 70.6,76.8 69.6,76.8 62.7,69.9 54.6,69.9 42.1,82.4 42.1,87.2 39.4,89.9 26.5,89.9 26.3,89.7 26.3,89.3 26.5,89.1 38,89.1 40.4,86.7 40.4,80.4 53,67.8 67.6,67.8 70.6,70.8
3V3  (via drill 0.2)
  Top 0.152: TC1.1 55.41,7.2 58,7.2 R9.2
  Top 0.254: U1.45 v67.9,22.4 | U1.46 v67.4,22.4 | U1.39 70.9,23.1 v71.1,23.3 C3.1 | U1.26 77,16.2 77.2,16 v77.8,16 C2.1 | U1.7 69.4,7.7 v69.2,7.5 C1.1 | U1.55 62.7,16.2 v62.6,16.3 C4.1 | U1.52 v63.2,17.7 | v51,24.9 C16.1 52.3,24.9 52.75,25.35 U6.1 | R18.2 v52.7,22.4 | U5.1 48.45,15.75 48.9,15.3 C14.1 v48.9,14 | R11.2 v51.4,15.7 | U5.2 50.15,17.05 v50.3,16.9 | U5.15 46.25,17.05 v46.1,16.9 | U5.10 46.25,19.55 v46.1,19.7 | U6.10 56.55,27.55 v56.7,27.7 | U6.15 54.05,27.55 v53.9,27.7 | U6.2 54.05,23.65 v53.9,23.5
  Top 0.305: R3.2 R4.2 v73.7,24.9 | R14.2 v51.2,12 | R5.2 R7.2 76,24.9 v76.5,25.4
  Route15 0.305: v53.9,27.7 53.9,25.3 | v56.7,27.7 56.7,25.3 | v46.1,16.9 48.5,16.9 | v46.1,19.7 48.6,19.7
  other vias: 79.9,13 79.4,13 82.7,37 82.7,37.5 82.7,38 82.7,38.5 83.8,76.3 83.8,76.9 81.5,77.8 82.1,77.8 82.7,77.8 83.3,77.8 81.5,72.8 82.1,72.8 82.7,72.8 83.3,72.8 55.14,6.93
  pour Top (no thermals): 83.5,73.6 81,73.6 80.92,73.53 79.9,73.53 79.9,73.17 80.83,73.17 81.4,72.6 83.5,72.6
  pour Top (no thermals): 83.5,78.6 81,78.6 80.92,78.53 79.9,78.53 79.9,78.17 80.83,78.17 81.4,77.6 83.5,77.6
  pour Top (no thermals): 83.9,76.2 82.8,76.2 82.8,77 83.9,77
  pour Top (no thermals): 82.8,36.8 81.7,36.8 81.7,38.6 82.8,38.6
  pour Top (no thermals): 81,12.8 81,14.2 79.2,14.2 79.2,12.8
  pour Route15 (rank 2): 82.3,83.6 83,84.3 84.1,84.3 84.8,83.6 84.8,11.3 74.5,1 52.2,1 48.2,5 48.2,22.6 51.2,25.6 75.5,25.6 82.3,32.4 82.3,71.7 81.4,72.6 81.4,78.6 82.3,79.5
3V3_DAC_OPA  (via drill 0.2)
  Top 0.305: U7.8 73.65,42.35 73.9,42.6 C24.1 v73.3,43.3 | U9.8 72.75,35.25 73,35.5 C25.1 v73.9,36.1 | U8.1 C21.1 v75.1,29
  other vias: 79.2,37.8 79.2,38.3 79.7,38.3 79.7,37.8
  pour Top (no thermals): 80.7,36.8 80.7,37.6 79.8,37.6 79.8,38.4 79.1,38.4 79.1,36.8
  pour Route15: 80.4,42.1 80.4,32.9 75,27.5 66.5,27.5 63.5,30.5 63.5,42.4 66.1,45 77.5,45
3V3_RF_GP  (via drill 0.2, 0.3)
  Top 0.2: U19.8 v27.49,49.91 v27.5,49.9 | U22.8 57.12,47.92 v57.1,47.9
  Top 0.254: U20.12 39.57,40.41 C86.1 C84.1 v41.18,40.4 | v43.48,38.8 C94.1 C96.1 45.68,38.8 45.79,38.91 U23.12 | U24.12 53.63,64.45 C98.1 C95.1 v53.58,66.1 | U21.12 28.97,63.81 28.78,64 C88.1 C85.1 v28.78,66.1 | R54.2 v22.28,51.8 | R56.2 v62.38,46
  Top 0.3: U17.18 31.95,24.5 32.18,24.73 v32.18,25.8 C76.1 C77.1 v32.18,28.1 | U17.2 v27.38,24
  Top 0.5: U29.2 12.1,44.3 v12.4,44.6 C144.1 C143.1
  Route15 0.152: v27.38,24 28.38,25 29.5,25 29.6,25 31.38,25 v32.18,25.8
  Route15 0.305: v53.58,66.1 52.48,65 29.48,65 28.78,65.7 v28.78,66.1
  other vias: 9.8,55.1 9.8,55.6 9.1,55.6 9.1,55.1 10.5,55.1 10.5,55.6
  pour Top (no thermals): 10.93,53.8 8.68,53.8 8.68,55.98 9.1,56.4 10.5,56.4 10.93,55.98
  pour Route15: 8.7,56 8.7,46.7 11.3,44.1 24.1,44.1 31.3,36.9 31.3,28.4 32,27.7 32.3,27.7 33.2,28.6 33.2,32.3 40.1,39.2 41.9,39.2 42.8,38.3 55.2,38.3 62.7,45.8 62.7,46.1 60.7,48.1 57,48.1 55.1,46.2 36.4,46.2 29.6,53 29.6,65.9 28.8,66.7 19.4,66.7
3V3_RF_RX  (via drill 0.2)
  Top 0.305: C59.1 54.65,78.25 v54.9,78.5 54.9,78.55 U15.29 | C55.1 C51.1 v57.5,76.4 | U15.21 54.95,82.9 v54.9,82.9 | U15.24 53.92,81.8 52,81.8 C68.1 C65.1 C62.1 v50.11,83.7 v50.1,83.7 | U15.16 57.8,84.28 57.8,84.89 C69.1 C66.1 C63.1 v60.3,87.39 v60.3,87.4 | U15.12 59.61,83.25 60.75,83.25 C58.1 | U15.10 60.07,82.3 60.2,82.3 C58.1 | C58.1 C54.1 C50.1 v62.79,84.9 v62.8,84.9
  other vias: 68.9,86.7 69.4,86.7 69.4,86.2 68.4,86.7 67.9,86.7 67.4,86.7
  pour Top (no thermals): 70.48,85.2 70.48,86.4 69.98,86.9 67.2,86.9 67.2,85.9 68.9,85.9 69.6,85.2
  pour Route15: 70.5,86.4 68.2,88.7 53.3,88.7 49.5,84.9 49.5,77.3 55.3,71.5 62.2,71.5 70.5,79.8
3V3_RF_TX  (via drill 0.2)
  Top 0.305: U12.7 32.94,84.4 33.4,84.4 C35.1 33.99,84.3 34.2,84.3 35.25,85.35 C32.1 C29.1 v36.39,87 v36.4,87 | U12.11 29.9,85.08 29.9,85.7 C46.1 C42.1 C38.1 v27.6,87.99 v27.6,88 | U12.17 27.74,83 26.71,83 | U12.19 U12.20 26.71,81.91 26.71,83 | 26.71,83 C36.1 C33.1 C30.1 v24.61,85.1 v24.6,85.1 | U12.23 27.18,79.35 C47.1 C43.1 C39.1 v24.31,77.5 v24.3,77.5 | U12.35 32.85,78.6 v32.9,78.6 | U12.33 U12.32 31.9,77.42 v31.9,77.4 | v31.9,77.4 C48.1 C44.1 C40.1 v30.7,74.91 v30.7,74.9 | v31.9,77.4
  other vias: 10.1,72.4 9.6,72.4 9.6,72.9 10.6,72.4 11.1,72.4 11.6,72.4
  pour Top (no thermals): 8.52,73.9 8.52,72.7 9.02,72.2 11.8,72.2 11.8,73.2 10.1,73.2 9.4,73.9
  pour Route15: 9.4,72.2 9.4,74.4 11.9,76.9 15.8,76.9 27.3,88.4 37.7,88.4 39.4,86.7 39.4,77.8 30.6,69 12.6,69
3V3_SYNTH  (via drill 0.2, 0.3)
  Top 0.254: U25.12 46.33,58.25 46.78,58.7 46.78,59.1 v47.18,59.5 C104.1 | C107.1 v47.28,52.5 46.78,53 46.78,53.3 46.33,53.75 U25.3 | C110.1 v37.38,54 37.63,54.25 U25.33 | C111.1 37.9,59.9 v38.38,59.9 39.08,59.9 39.55,59.43 U25.24 | v43.08,63.4 43.1,63.38 FB3.1 42.4,62 R59.2 | C108.1 45.3,60.42 v45.28,60.4 44.98,60.1 44.48,60.1 44.05,59.67 U25.15 | U25.48 45.05,51.55 45.8,50.8 L6.1 | U25.37 39.55,51.55 38.8,50.8 L5.1 | R61.2 v38.2,62
  Top 0.6: L6.1 C103.1 v46.8,50.7 | L5.1 C105.1 v37.8,50.7 | v37.8,50.7 | v46.8,50.7
  other vias: 70,52.4 69.5,52.4 69,52.4 68.5,52.4 69.5,53.4 69,53.4 70.5,52.4 70.5,52.9 68.5,53.4 70,52.9 69.5,52.9 69,52.9 68.5,52.9 70,53.4
  pour Top (no thermals): 71.58,50.9 71.58,52.1 70.08,53.6 68.3,53.6 68.3,51.6 70,51.6 70.7,50.9
  pour Route15 (no thermals): 70.7,53 65.3,58.4 55.1,58.4 49.4,64.1 39.2,64.1 37,61.9 37,50.3 38.5,48.8 54.5,48.8 56.6,50.9 70.7,50.9
5V0  (via drill 0.2)
  other vias: 74.1,91.6 74.6,91.6 75.1,91.6 75.6,91.6 5.4,72.9 5.4,72.4 4.9,72.4 4.4,72.4 3.9,72.4 3.4,72.4 15.8,33.3 15.8,32.8 15.3,32.8 14.8,32.8 14.3,32.8 13.8,32.8 7.1,48.6 7.1,49.1 7.1,51.6 7.1,51.1 7.1,50.6 7.1,50.1 7.1,49.6 74.7,51.9 76.2,52.4 76.7,52.4 75.7,52.4 75.2,52.4 74.7,52.4 13.6,37.8 13.6,38.4 77.7,84.7 78,84.3 78.3,84.7 78.6,84.3 78.9,84.7 79.2,84.3 77.2,85.5 76.7,86.1 77.2,86.7 78.5,60.8 78.5,61.4
  pour Top (no thermals): 6.48,73.4 6.48,72.7 5.98,72.2 3.2,72.2 3.2,73.2 4.8,73.2 5,73.4
  pour Top (no thermals): 72.52,85.7 72.52,86.4 73.32,87.2 78.7,87.2 79.7,86.2 79.7,82.6 79.1,82 77.8,82 77.2,82.6 77.2,84.7 76,85.9 74.2,85.9 74,85.7
  pour Top (no thermals): 16.88,33.8 16.88,33.1 16.38,32.6 13.6,32.6 13.6,33.6 15.2,33.6 15.4,33.8
  pour Top (no thermals): 13.5,38.5 14.6,38.5 14.6,37.7 13.5,37.7
  pour Top (no thermals): 73.62,51.4 73.62,52.1 74.12,52.6 76.9,52.6 76.9,51.6 75.3,51.6 75.1,51.4
  pour Top (no thermals): 9.1,48.2 9.1,50.7 9.03,50.77 9.03,51.8 6.9,51.8 6.9,48.2
  pour Route15: 73.5,86.4 73.5,82.8 72.5,81.8 72.5,64.6 74.2,62.9 74.2,51.8 74.6,51.4 76.6,51.4 79.7,54.5 79.7,94.3 76.3,97.7 10.3,97.7 1,88.4 1,42.3 10.7,32.6 16,32.6 16,36.7 7.3,45.4 7.3,75 13.5,81.2 16.8,81.2 26.8,91.2 68.7,91.2
  pour Top (no thermals): 72.52,91.1 72.52,91.3 73.02,91.8 75.8,91.8 75.8,90.8 73.6,90.8 73.3,91.1
  pour Top (no thermals): 78.4,61.5 79.5,61.5 79.5,60.7 78.4,60.7
5V0_RF_LO  (via drill 0.2, 0.3)
  Top 0.6: R50.2 35.44,30.9 v35.1,30.9
  Bottom 0.6: v35.1,30.9 v29.6,30.9
  other vias: 20,33.3 22,32.8 21.5,32.8 21,32.8 20.5,32.8 20,32.8 24.1,28.4 23.6,28.4 24.1,28.9 23.6,28.9
  pour Top (no thermals): 18.92,34.3 18.92,33.1 19.42,32.6 22.2,32.6 22.2,33.6 20.5,33.6 19.8,34.3
  pour Route15: 19.7,33.6 28.2,33.6 29.9,31.9 29.9,30.7 27.3,28.1 23.4,28.1 19.7,31.8
  pour Top (no thermals): 23.4,27.6 23.4,29 24.3,29 24.3,27.6
!MCU_RESET  (via drill 0.2)
  Top 0.127: U1.20 v74.6,13.2 | v71.9,3.9 60.9,3.9 59,5.8 R9.1
  Top 0.152: TC1.10 55.41,5.4 58,5.4 R9.1
  Bottom 0.127: v71.9,3.9 73.61,3.9 75.82,6.11 75.82,10.49 74.6,11.71 v74.6,13.2
  other vias: 55.14,5.67
!RX_RST_1V8  (via drill 0.2)
  Top 0.127: R16.1 v54.3,30.4 54.9,31 Q1.3 | v47,79.6 45.5,78.1 v45.5,75.7
  Top 0.2: U15.22 54.14,83 v54.1,83
  Bottom 0.127: v54.1,83 51.3,80.2 48.59,80.2 47.99,79.6 v47,79.6 | v45.5,75.7 45.5,74.18 47.64,72.04 47.64,63.54 53.54,57.64 53.54,32.64 54.3,31.88 v54.3,30.4
!RX_SPI_CS  (via drill 0.2)
  Top 0.127: U6.3 54.55,23.35 54.3,23.1 R18.1 v54.3,21.8 | v56.7,21.8 60,25.1 R22.1 63.8,25.9 66.4,23.3 U1.48
  Bottom 0.127: v54.3,21.8 v56.7,21.8
!RX_SPI_CS_1V8  (via drill 0.2)
  Top 0.127: U6.14 54.55,27.75 54.3,28 R17.1 v54.9,28.8 | v47.8,78.8 46.3,77.3 v46.3,74.9
  Top 0.2: U15.1 57.83,77.9 v57.9,77.9
  Bottom 0.127: v57.9,77.9 57.4,77.9 56.2,79.1 50.8,79.1 50.13,79.77 48.77,79.77 v47.8,78.8 | v46.3,74.9 46.3,73.99 48.07,72.22 48.07,63.72 53.97,57.82 53.97,32.82 55.67,31.12 55.67,29.18 55.29,28.8 v54.9,28.8
!RX_SPI_OE
  Top 0.127: U6.9 58.95,25.85 | R22.2 R21.1
  Top 0.152: 58.95,25.85 R22.2
!SYNTH_RESET  (via drill 0.2)
  Top 0.127: v65.7,12.7 U1.62
  Top 0.2: U25.31 38.15,55.25 v38.1,55.3
  Bottom 0.127: v38.1,55.3 36.5,55.3 35.7,54.5 33.83,54.5 33.4,54.06 33.4,40.1 60.8,12.7 v65.7,12.7
!SYNTH_SPI_CS  (via drill 0.2)
  Top 0.127: v67.9,11.3 U1.4
  Top 0.2: U25.25 38.15,58.25 v38.1,58.3
  Bottom 0.127: v38.1,58.3 35.8,58.3 32.1,54.6 32.1,39.57 61.62,10.05 67.05,10.05 67.9,10.9 v67.9,11.3
!TX_RST_1V8  (via drill 0.2)
  Top 0.127: Q2.3 v43.43,17.87 R20.1
  Top 0.2: U12.1 34.58,81.8 v34.8,81.8
  Bottom 0.127: v34.8,81.8 34.8,82.81 31.78,85.83 28.79,85.83 27.46,87.16 24.04,87.16 23.34,86.46 14.14,86.46 11.14,83.46 11.14,77.94 17.94,71.14 17.94,41.54 12.3,35.9 12.3,28.4 13.5,27.2 13.5,14.8 17,11.3 36.17,11.3 42.73,17.87 v43.43,17.87
!TX_SPI_CS  (via drill 0.2)
  Top 0.127: U5.3 50.45,17.55 50.7,17.3 R11.1 v52,17.3 62.7,17.3 62.8,17.2 U1.53 | R13.1 48.6,22.3 v48.6,21.2
  Bottom 0.127: v52,17.3 48.6,20.7 v48.6,21.2
!TX_SPI_CS_1V8  (via drill 0.2)
  Top 0.127: U5.14 46.05,17.55 45.8,17.3 R10.1 45,18 v43.6,19.4
  Top 0.2: U12.40 34.58,80.4 v34.6,80.4 | U12.18 27.63,82.4 v27.3,82.4
  Bottom 0.127: v34.6,80.4 34.6,80.7 30.9,84.4 29,84.4 28.6,84.8 | v27.3,82.4 28.6,83.7 28.6,84.8 | 28.6,84.8 27.1,86.3 24.4,86.3 23.7,85.6 14.5,85.6 12,83.1 12,78.3 18.8,71.5 18.8,41.18 13.16,35.54 13.16,28.76 14.36,27.56 14.36,15.16 17.36,12.16 35.81,12.16 42.79,19.15 43.35,19.15 v43.6,19.4
!TX_SPI_OE
  Top 0.127: U5.9 47.95,21.95 | R13.2 R12.1
  Top 0.152: 47.95,21.95 R13.2
-3V3_RF_GP  (via drill 0.2)
  Top 0.254: U20.9 38.87,38.91 38.98,38.8 C90.1 C87.1 v41.18,38.8 | U23.9 45.09,40.41 C97.1 C100.1 v43.48,40.4 | U24.9 55.13,63.85 55.28,64 C101.1 C99.1 v55.28,66.1 | U21.9 C91.1 C89.1 v30.48,66.1
  Top 0.3: U17.17 32.28,24 33.18,24.9 C75.1 C74.1 v34.78,25.5
  Route15 0.305: v55.28,66.1 54.38,67 51.9,67 50.9,66 30.58,66 v30.48,66.1 29.38,67.2 19.2,67.2 8.1,56.1 8.1,46.5 11,43.6 v12.8,43.6 v13.4,43.6 v14,43.6 v14.6,43.6 v15.2,43.6 23.9,43.6 30.8,36.7 30.8,28.2 31.8,27.2 32.4,27.2 33.68,28.48 | v43.48,40.4 42.78,40.4 v41.18,38.8 40.48,38.8 33.68,32 33.68,28.48 | v34.78,25.5 33.68,26.6 33.68,28.48
  pour Top (no thermals): 15.4,43.8 12.1,43.8 11.82,43.52 10.8,43.52 10.8,43.17 11.18,42.8 15.4,42.8
DAC_I2C_SCL  (via drill 0.2)
  Top 0.127: R3.1 v72.1,23.3 72.9,22.5 U1.35 | U8.2 71.5,29.5 v70.2,28.2
  Bottom 0.127: v72.1,23.3 72.1,25.6 72.1,25.9 70.2,27.8 v70.2,28.2
DAC_I2C_SDA  (via drill 0.2)
  Top 0.127: R4.1 v73.1,23.3 73.4,23 U1.34 | U8.3 71.4,30 v69.6,28.2
  Bottom 0.127: v69.6,28.2 69.6,28.09 70.45,27.25 70.7,27 71.88,25.81 71.88,23.78 71.6,23.5 71.6,23.1 71.9,22.8 72.6,22.8 v73.1,23.3
EXT_IO_1_3  (via drill 0.2)
  Top 0.127: JP1.4 73.65,58.42 81.22,58.42 81.4,58.6 v82.1,58.6 | v82.3,26.8 82.3,26.5 78.59,22.78 76.48,22.78 v76.2,22.5 | U1.37 v71.9,19.4
  Bottom 0.127: v82.1,58.6 82.1,58 81.62,57.52 81.62,31.69 82.02,31.29 82.02,27.68 82.3,27.4 v82.3,26.8 | v76.2,22.5 75.28,21.58 72.8,21.58 71.9,20.68 v71.9,19.4
EXT_IO_1_4  (via drill 0.2)
  Top 0.127: JP1.3 71.33,58.2 v81.7,58.2 | v81.8,27.1 81.8,26.3 78.5,23 76,23 v75.7,22.7 | U1.38 v71.4,19.9 | v69.1,23.3 R23.1
  Bottom 0.127: v81.7,58.2 81.4,57.9 81.4,31.6 81.8,31.2 v81.8,27.1 | v75.7,22.7 74.8,21.8 72.71,21.8 71.4,20.49 v71.4,19.9 69.1,22.2 v69.1,23.3
EXT_IO_1_5  (via drill 0.2)
  Top 0.127: JP1.6 75.98,58.63 81.13,58.63 81.5,59 v82.5,59 | v82.8,26.5 82.61,26.5 78.68,22.57 77.06,22.57 v76.7,22.21 | U1.36 v72.4,19.9
  Bottom 0.127: v82.5,59 82.5,58.09 81.83,57.43 81.83,31.78 82.23,31.38 82.23,27.77 82.8,27.2 v82.8,26.5 | v76.7,22.21 75.86,21.37 72.89,21.37 72.4,20.88 v72.4,19.9
EXT_LO_AMP1_IN
  pour Top (no thermals): 18.54,22.8 18.54,22.2 19.04,22.2 19.14,22.25 19.64,22.25 19.64,21.75 20.24,21.75 20.24,22.25 20.74,22.38 21.24,22.38 21.24,22.62 20.74,22.62 20.24,22.75 19.14,22.75 19.04,22.8
EXT_LO_AMP1_OUT
  pour Top (no thermals): 23.04,22.38 22.54,22.38 22.54,22.62 23.04,22.62 23.54,22.75 23.54,23.25 24.14,23.25 24.14,22.75 24.64,22.75 24.74,22.8 25.24,22.8 25.24,22.2 24.74,22.2 24.64,22.25 23.54,22.25
EXT_LO_AMP1_VDD
  Top 0.6: L2.1 R49.1
  pour Top (no thermals): 23.04,25.36 23.04,24.76 23.54,24.76 23.54,23.76 24.14,23.76 24.14,26.21 23.04,26.21 23.04,25.61 23.54,25.61 23.54,25.36
EXT_LO_AMP2_IN
  pour Top (no thermals): 36.19,24.58 35.83,24.23 36.26,23.8 36.61,24.16 36.65,24.26 37,24.62 37.35,24.26 37.78,24.69 37.43,25.04 37.69,25.48 38.04,25.84 38.04,25.84 37.87,26.01 37.87,26.01 37.51,25.66 37.07,25.39 36.65,24.97 36.29,24.62
EXT_LO_AMP2_OUT
  pour Top (no thermals): 38.79,26.93 39.14,27.29 39.41,27.73 39.05,28.08 39.44,28.47 39.48,28.51 39.83,28.15 40.18,28.51 40.22,28.61 40.57,28.97 40.6,28.93 41,28.54 40.64,28.19 40.54,28.15 39.76,27.37 39.32,27.11 38.96,26.76
EXT_LO_AMP2_VDD
  Top 0.6: L4.1 R50.1
  pour Top (no thermals): 37.38,30.6 36.61,29.82 37.03,29.4 37.38,29.75 37.56,29.57 37.21,29.22 37.63,28.79 37.99,29.15 38.34,28.79 38.69,28.44 39.12,28.87 38.41,29.57 37.99,30 37.81,30.17
EXT_LO_ATT_CLK  (via drill 0.2)
  Top 0.127: v71.4,11 U1.11
  Top 0.2: U17.24 28.67,25.43 v28.4,25.7
  Bottom 0.127: v28.4,25.7 28.02,25.32 28.02,22.4 29.7,20.72 47.59,20.72 51.89,16.42 53.39,16.42 61.09,8.72 68.01,8.72 68.91,9.62 70.02,9.62 v71.4,11
EXT_LO_ATT_IN
  pour Top (no thermals): 26.25,22.2 25.75,22.2 25.75,22.8 26.25,22.8 26.35,22.75 27.35,22.75 27.85,22.62 28.35,22.62 28.35,22.38 27.85,22.38 27.35,22.25 26.35,22.25
EXT_LO_ATT_LE  (via drill 0.2)
  Top 0.127: v70.9,8.4 U1.10
  Top 0.2: U17.1 27.68,24.5 v27.38,24.8
  Bottom 0.127: v27.38,24.8 27.8,24.38 27.8,22.31 29.61,20.5 47.5,20.5 51.8,16.2 53.3,16.2 61,8.5 68.1,8.5 69,9.4 69.9,9.4 v70.9,8.4
EXT_LO_ATT_OUT
  pour Top (no thermals): 32,22.38 31.5,22.38 31.5,22.62 32,22.62 32.5,22.75 33.5,22.75 33.69,22.76 33.89,22.78 34.08,22.83 34.26,22.89 34.45,22.96 34.62,23.05 34.79,23.16 34.94,23.28 35.09,23.41 35.12,23.52 35.48,23.87 35.87,23.48 35.9,23.44 35.55,23.09 35.44,23.06 35.26,22.89 35.07,22.75 34.87,22.62 34.66,22.51 34.44,22.42 34.21,22.34 33.97,22.29 33.74,22.26 33.5,22.25 32.5,22.25
EXT_LO_ATT_SERIN  (via drill 0.2)
  Top 0.127: v70.4,11.3 U1.9
  Top 0.2: U17.23 29.17,25.63 v29.1,25.7
  Bottom 0.127: v29.1,25.7 28.23,24.83 28.23,22.49 29.79,20.93 47.68,20.93 51.98,16.63 53.48,16.63 61.18,8.93 67.92,8.93 68.82,9.83 69.93,9.83 70.4,10.3 v70.4,11.3
EXT_LO_DIV_IN
  pour Top (no thermals): 41.36,28.9 40.93,29.32 41.28,29.68 41.39,29.71 41.52,29.86 41.64,30.01 41.75,30.18 41.84,30.35 41.91,30.54 41.97,30.72 42.02,30.91 42.04,31.11 42.05,31.3 42.05,32.3 42.01,32.31 41.96,32.31 41.92,32.32 41.88,32.34 41.84,32.36 41.8,32.38 41.76,32.4 41.73,32.43 41.7,32.46 41.67,32.5 41.65,32.54 41.39,32.5 41.14,32.94 41.18,32.96 41.66,33.24 41.91,32.8 41.76,32.6 41.78,32.57 41.8,32.55 41.82,32.52 41.84,32.5 41.87,32.48 41.9,32.47 41.92,32.46 41.96,32.45 41.99,32.44 42.02,32.43 42.05,32.43 42.55,32.43 42.58,32.43 42.61,32.44 42.64,32.45 42.68,32.46 42.7,32.47 42.73,32.48 42.76,32.5 42.78,32.52 42.8,32.55 42.82,32.57 42.84,32.6 42.69,32.8 42.94,33.24 43.46,32.94 43.21,32.5 42.95,32.54 42.93,32.5 42.9,32.46 42.87,32.43 42.84,32.4 42.8,32.38 42.76,32.36 42.72,32.34 42.68,32.32 42.64,32.31 42.59,32.31 42.55,32.3 42.55,31.3 42.54,31.06 42.51,30.83 42.46,30.59 42.38,30.36 42.29,30.14 42.18,29.93 42.05,29.73 41.91,29.54 41.74,29.36 41.71,29.25
EXT_LO_IN
  pour Top (no thermals): 13.35,22 12.4,22 12.4,23 13.35,23 13.6,22.75 17.43,22.75 17.53,22.8 18.03,22.8 18.03,22.2 17.53,22.2 17.43,22.25 13.6,22.25
EXT_RX_LO
  pour Top (no thermals): 42.55,35.38 42.55,34.78 43.05,34.78 43.05,34.78 43.15,35.02 43.15,35.02 43.19,35.02 43.22,35.01 43.25,35 43.28,34.99 43.31,34.98 43.34,34.96 43.36,34.94 43.39,34.92 43.41,34.9 43.43,34.88 43.45,34.85 43.7,34.42 43.71,34.39 43.72,34.36 43.73,34.33 43.74,34.3 43.74,34.26 43.74,34.23 43.74,34.2 43.73,34.17 43.72,34.14 43.71,34.11 43.7,34.08 43.44,34.11 43.19,33.68 43.23,33.65 43.71,33.38 43.96,33.81 43.81,34.02 43.83,34.05 43.84,34.1 43.85,34.14 43.86,34.18 43.87,34.23 43.87,34.27 43.86,34.31 43.85,34.36 43.84,34.4 43.83,34.44 43.81,34.48 43.94,34.55 44.08,34.61 44.23,34.65 44.38,34.69 44.53,34.71 44.68,34.71 45.68,34.71 45.9,34.72 46.12,34.76 46.33,34.81 46.54,34.88 46.74,34.98 46.93,35.09 47.11,35.22 47.27,35.37 47.42,35.54 47.55,35.71 47.66,35.9 47.76,36.1 47.83,36.31 47.89,36.52 47.92,36.74 47.93,36.96 47.93,37.46 47.81,37.96 47.81,38.46 47.56,38.46 47.56,37.96 47.43,37.46 47.43,36.96 47.42,36.79 47.4,36.62 47.36,36.46 47.3,36.29 47.22,36.14 47.14,35.99 47.03,35.85 46.92,35.73 46.79,35.61 46.65,35.51 46.51,35.42 46.35,35.35 46.19,35.29 46.02,35.25 45.85,35.22 45.68,35.21 44.68,35.21 44.48,35.2 44.29,35.18 44.1,35.14 43.91,35.08 43.73,35 43.56,34.91 43.53,34.95 43.5,34.98 43.47,35.02 43.44,35.04 43.4,35.07 43.37,35.09 43.33,35.11 43.28,35.12 43.24,35.14 43.2,35.14 43.15,35.14 43.15,35.14 43.05,35.38 43.05,35.38
EXT_TX_LO
  pour Top (no thermals): 36.67,37.46 36.67,36.96 36.68,36.74 36.71,36.52 36.77,36.31 36.84,36.1 36.94,35.9 37.05,35.71 37.18,35.54 37.33,35.37 37.49,35.22 37.67,35.09 37.86,34.98 38.06,34.88 38.27,34.81 38.48,34.76 38.7,34.72 38.92,34.71 39.92,34.71 40.07,34.71 40.22,34.69 40.37,34.65 40.52,34.61 40.66,34.55 40.79,34.48 40.77,34.44 40.76,34.4 40.75,34.36 40.74,34.31 40.73,34.27 40.73,34.23 40.74,34.18 40.75,34.14 40.76,34.1 40.77,34.05 40.79,34.02 40.64,33.81 40.89,33.38 41.37,33.65 41.41,33.68 41.16,34.11 40.9,34.08 40.89,34.11 40.88,34.14 40.87,34.17 40.86,34.2 40.86,34.23 40.86,34.26 40.86,34.3 40.87,34.33 40.88,34.36 40.89,34.39 40.9,34.42 41.15,34.85 41.17,34.88 41.19,34.9 41.21,34.92 41.24,34.94 41.26,34.96 41.29,34.98 41.32,34.99 41.35,35 41.38,35.01 41.41,35.02 41.45,35.02 41.55,34.78 42.05,34.78 42.05,35.38 41.55,35.38 41.45,35.14 41.4,35.14 41.36,35.14 41.32,35.12 41.27,35.11 41.23,35.09 41.2,35.07 41.16,35.04 41.13,35.02 41.1,34.98 41.07,34.95 41.04,34.91 40.87,35 40.69,35.08 40.5,35.14 40.31,35.18 40.12,35.2 39.92,35.21 38.92,35.21 38.75,35.22 38.58,35.25 38.41,35.29 38.25,35.35 38.09,35.42 37.95,35.51 37.81,35.61 37.68,35.73 37.57,35.85 37.46,35.99 37.38,36.14 37.3,36.29 37.24,36.46 37.2,36.62 37.18,36.79 37.17,36.96 37.17,37.46 37.04,37.96 37.04,38.46 36.79,38.46 36.79,37.96
GND  (via drill 0.2, 3 pad 5.5)
  Top 0.2: RFCON7.P$2 60.66,63.24 v60.68,63.26 | RFCON7.P$1 60.66,60.49 v60.68,60.46 | RFCON6.P$1 25,63.24 v25.02,63.26 | RFCON6.P$2 25,60.49 v25.02,60.46
  Top 0.254: U21.11 29.47,61.86 U21.17 | U21.13 28.97,62.36 v29.12,62.21 | U21.15 29.47,61.36 | U21.16 28.97,60.86 | U21.1 28.97,60.86 | 28.97,60.86 v29.12,61.01 | U21.2 29.47,61.36 | 29.47,61.36 U21.17 | U21.4 30.47,60.86 | U21.5 30.47,60.86 | 30.47,60.86 v30.32,61.01 | U21.6 29.97,61.36 U21.17 | U21.8 30.47,62.36 v30.32,62.21 | U24.4 55.13,60.86 | U24.5 55.13,60.86 | 55.13,60.86 v54.98,61.01 | U24.6 54.63,61.36 U24.17 | U24.2 54.13,61.36 | U24.1 53.63,60.86 | U24.16 53.63,60.86 | 53.63,60.86 v53.78,61.01 | U24.13 53.63,62.36 v53.78,62.21 | U24.8 55.13,62.36 v54.98,62.21 | U24.11 54.13,61.86 U24.17 | U24.15 54.13,61.36 | 54.13,61.36 U24.17 | U23.11 47.68,39.41 47.84,39.58 | 47.84,39.58 U23.17 48.18,39.91 U23.6 | U23.13 47.18,38.91 v47.33,39.06 | U23.15 48.18,39.24 48.01,39.41 | U23.16 48.68,38.91 | U23.1 48.68,38.91 | 48.68,38.91 v48.53,39.06 | U23.2 48.01,39.41 | 48.01,39.41 47.84,39.58 | U23.4 48.68,40.41 | U23.5 48.68,40.41 | 48.68,40.41 v48.53,40.26 | U23.8 47.18,40.41 v47.33,40.26 | U20.2 36.42,39.91 | U20.11 36.92,39.91 U20.17 | U20.6 36.42,39.41 U20.17 | U20.5 35.92,38.91 | U20.4 35.92,38.91 | 35.92,38.91 v36.07,39.06 | U20.8 37.42,38.91 v37.27,39.06 | U20.1 35.92,40.41 | U20.16 35.92,40.41 | 35.92,40.41 v36.07,40.26 | U20.15 36.42,39.91 | 36.42,39.91 U20.17 | U20.13 37.42,40.41 v37.27,40.26 | U17.8 29.17,22.12 28.98,22.31 28.67,22 | U17.9 29.67,22.22 29.58,22.31 | U17.10 30.17,22.2 30.28,22.31 | U17.11 30.67,22.1 30.88,22.31 31.17,22.02 | 30.88,23.61 30.99,23.5 U17.16 U17.15 30.98,23 v30.88,22.9 | U17.11 U17.12 31.17,22.02 | U17.11 U17.10 | U17.10 U17.9 | U17.9 U17.8 | U17.8 U17.7 28.67,22 | 28.98,22.91 28.89,23 U17.4 U17.3 28.87,23.5 28.98,23.61 | U17.13 31.19,22 31.17,22.02
  Top 0.254: U17.6 28.67,22 | U25.44 43.05,53.05 v43.3,53.3 | v44.5,53.3 44.55,53.25 U25.47 44.55,51.45 v44.6,51.4 | U25.41 41.55,52.95 v41.9,53.3 | v40.1,53.3 40.05,53.25 U25.38 40.05,51.45 v40,51.4 | U25.20 41.55,57.95 v41.3,57.7 | U25.19 42.05,57.85 v41.9,57.7 | U25.17 43.05,57.95 v43.3,57.7 | U25.14 44.55,57.75 v44.5,57.7 | U6.7 56.55,24.85 56,25.4 v56,25.6 56.25,25.35 U6.8 | U5.7 48.95,19.55 48.45,19.05 | v48.2,19 48.4,19 48.45,19.05 | U5.8 48.45,19.05
  Top 0.305: v30.7,83.9 30.7,84.28 U12.10 31.35,84.93 v31.35,84.95 | v32.1,84.25 v32.09,84.26 U12.8 31.23,83.4 v31.2,83.4 | U12.27 29.7,79.04 v29.7,79.3 | U12.36 32,80.15 v32,80.6 | U12.39 33.5,80.78 v33.5,81.1 | U15.28 55.8,80.15 v55.8,80.3 | U15.25 54.62,81.1 v55,81.1 | U15.19 56.46,82.8 v56.7,82.8 | v57.1,83.2 57.1,83.58 U15.17 56.5,84.17 v56.5,84.4 | U15.13 58.05,82.4 v57.9,82.4 | U15.5 58.4,80.15 v58.4,80.3 | U7.4 70.75,40.85 v71.1,41.2 | U9.4 69.75,33.75 v70.1,34.1 | U33.6 7.3,73.85 v7.5,74.05 | U27.6 17.7,34.25 v17.9,34.45 | U34.6 72.15,85.25 v71.9,85.5 | U32.3 70.85,90.15 v71.1,90.4 | U32.6 72.15,90.15 v71.9,90.4 | U28.6 72.8,50.95 v72.6,50.75 | C90.2 v39.58,37.2 | C87.2 v40.58,37.2 | C94.2 v44.08,37.2 | C96.2 v45.08,37.2 | v44.08,42 C100.2 | C97.2 v45.08,42 | v40.58,42 C84.2 | C86.2 v39.58,42 | C92.2 v60.8,46.6 | C99.2 v56.9,65.5 | C101.2 v56.9,64.5 | C98.2 v52,64.5 | C95.2 v52,65.5 | C89.2 v32.1,65.5 | C91.2 v32.1,64.5 | C85.2 v27.2,65.5 | C88.2 v27.2,64.5 | C82.2 v23.28,51.8 | C63.2 v58.7,88.1 | v58.7,88.1 | C66.2 v58,87.4 | v58,87.4 | C69.2 v57.3,86.7 | v57.3,86.7 | C61.2 | C61.2 v61.7,85.1 | C64.2 v61,84.4 | v61,84.4 | C67.2 60.2,83.8 v60.4,83.8 | C50.2 v63.5,83.3 | v63.5,83.3 | C54.2 v62.8,82.6 | v62.8,82.6 | C58.2 v62.1,81.9 | v62.1,81.9 | C62.2 v49.4,82.1 | C65.2 v50.1,81.4 | C68.2 v50.8,80.7 | v51.6,79.5 v51.6,79.49 R48.1 v51.6,78.6 | C59.2 v53.5,76.7 | C57.2 | C57.2 v56.6,75.9 | C53.2 v55.9,75.2 | v55.9,75.2 | C49.2 v55.2,74.5 | v55.2,74.5 | C51.2 v57.5,74.2 | C55.2 v58.5,74.2 | C40.2 v32.3,74.2 | v32.3,74.2 | C44.2 v33,74.9 | v33,74.9 | C48.2 v33.7,75.6 | v33.7,75.6 | R44.1 | R44.1 v34.4,76.3 | R45.1 v35.1,77 | v35.1,77 | C39.2 v23.6,79.1 | v23.6,79.1 | C43.2 v24.3,79.8 | v24.3,79.8 | C47.2 v25,80.5 | v25,80.5 | C36.2 v25.3,82.1
  Top 0.305: C33.2 v24.6,82.8 | C30.2 v23.9,83.5 | C46.2 v30.6,87.3 | C42.2 v29.9,88 | C38.2 v29.2,88.7 | C37.2 v26.2,85.7 | C41.2 v26.9,85 | C45.2 v27.6,84.3 | R42.1 v35.7,84.01 v35.7,84 | C32.2 v36.4,84.7 | v36.4,84.7 | C29.2 v37.1,85.4 | v37.1,85.4 | C35.2 34.5,85.5 v34.5,86 | C34.2 v36.7,81.6 | v36.7,81.6 | C31.2 v37.4,82.3 | v37.4,82.3 | C28.2 v38.1,83 | v38.1,83 | C76.2 v30.6,26.5 | C77.2 v30.6,27.5 | C75.2 v33.18,27.1 | C74.2 v34.18,27.1 | v37.18,46 R69.1 37.8,46.58 v37.78,46.6 | v47.38,46 R70.1 46.78,46.02 v46.78,46.6 | U25.49 v42.7,55.1 | U17.25 v30.28,23.6 | v29.58,22.9 U17.25 | U17.25 29.58,22.91 28.98,22.91 | U17.25 29.92,22.87 29.17,22.12 | RFCON1.P$1 11.57,67.58 v11.6,67.6 | RFCON1.P$1 12.07,67.58 v12.1,67.6 | 12,67.5 11.93,67.58 RFCON1.P$1 | RFCON1.P$2 11.32,64.8 v12.1,64.8 | RFCON5.P$1 12.07,23.88 v12.1,23.9 | RFCON5.P$2 11.6,21.12 11.62,21.1 v12.1,21.1 | RFCON3.P$1 80.33,64.8 v81.1,64.8 | RFCON3.P$2 81.08,67.58 v81.1,67.6 | U13.4 67.3,71.89 v67.3,71.8 | U13.2 65.21,69.8 v65.3,69.8 | U10.2 21.79,70.5 v21.7,70.5 | U10.4 19.7,72.59 v19.7,72.5
  Top 0.508: 26.17,75.58 U11.2